# EAGLE design pan132x_breakout (EAGLE 7.1.0)
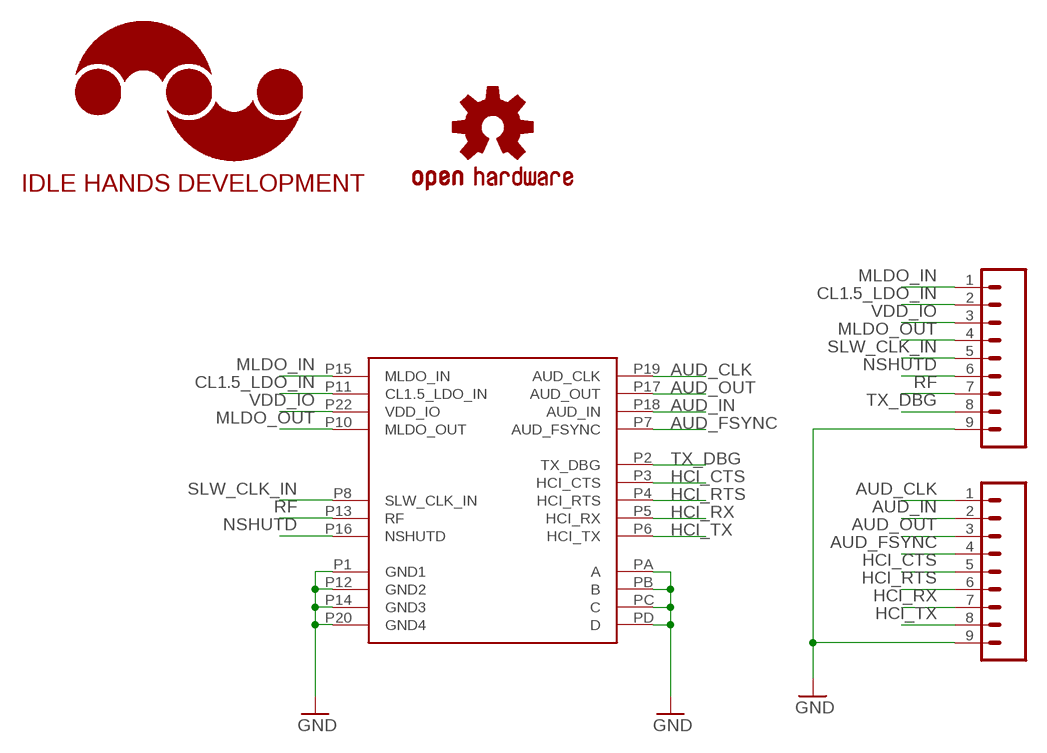
[diagram p0: schematic, sheet 1]

## Parts
JP1  M09LOCK  [1X09_LOCK]
JP2  M09LOCK  [1X09_LOCK]
LOGO1  IDLEHANDS_LOGOL  [IHD-LOGO-L]
LOGO2  OSHW-LOGOS  [OSHW-LOGO-S]
U$1  PAN132X  [PAN13XX]

## Nets
AUD_CLK: JP2.1 U$1.P19(AUD_CLK)
AUD_FSYNC: JP2.4 U$1.P7(AUD_FSYNC)
AUD_IN: JP2.2 U$1.P18(AUD_IN)
AUD_OUT: JP2.3 U$1.P17(AUD_OUT)
CL1.5_LDO_IN: JP1.2 U$1.P11(CL1.5_LDO_IN)
GND: JP1.9 JP2.9 U$1.P1(GND1) U$1.P12(GND2) U$1.P14(GND3) U$1.P20(GND4) U$1.PA(A) U$1.PB(B) U$1.PC(C) U$1.PD(D)
HCI_CTS: JP2.5 U$1.P3(HCI_CTS)
HCI_RTS: JP2.6 U$1.P4(HCI_RTS)
HCI_RX: JP2.7 U$1.P5(HCI_RX)
HCI_TX: JP2.8 U$1.P6(HCI_TX)
MLDO_IN: JP1.1 U$1.P15(MLDO_IN)
MLDO_OUT: JP1.4 U$1.P10(MLDO_OUT)
NSHUTD: JP1.6 U$1.P16(NSHUTD)
RF: JP1.7 U$1.P13(RF)
SLW_CLK_IN: JP1.5 U$1.P8(SLW_CLK_IN)
TX_DBG: JP1.8 U$1.P2(TX_DBG)
VDD_IO: JP1.3 U$1.P22(VDD_IO)

## Library data of the parts
JP1 JP2 = SparkFun-Connectors:M09: Header 9 Standard 9-pin 0.1" header. Use with straight break away headers (SKU : PRT-00116), right angle break away headers (PRT-00553), swiss pins (PRT-00743), machine pins (PRT-00117), and female headers (PRT-00115).
LOGO1 = IdleHandsProject:IDLEHANDS_LOGO: Open Source Hardware Logo This logo indicates the piece of hardware it is found on incorporates a OSHW license and/or adheres to the definition of open source hardware found here: http://freedomdefined.org/OSHW
LOGO2 = SparkFun-Aesthetics:OSHW-LOGO: Open Source Hardware Logo This logo indicates the piece of hardware it is found on incorporates a OSHW license and/or adheres to the definition of open source hardware found here: http://freedomdefined.org/OSHW
U$1 = BluetoothBLE_SPP:PAN132X

## Board
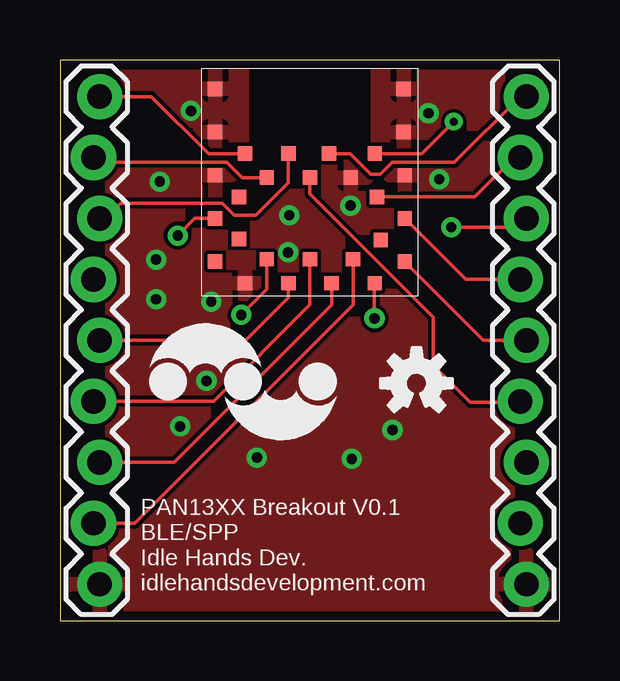
[diagram p1: board, top side]
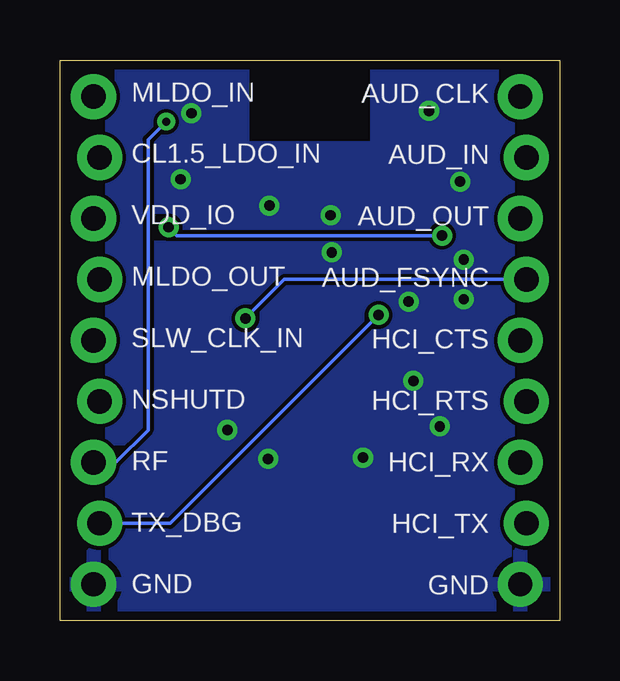
[diagram p2: board, bottom side, seen from below]

Size 20.83 x 23.37 mm. Coordinates in mm from the lower left corner, seen from the top.
Outline: 0,0 20.83,0 20.83,23.37 0,23.36 0,0
Copper layers (1*16): Top 0.035mm / dielectric 1.5mm / Bottom 0.035mm
Design rules "default *": minimum track width 6mil, minimum drill 6mil, track to track 6mil, track to pad 6mil, pad to pad 6mil, via to via 6mil, smd to smd 6mil, copper to edge 15mil, drill to drill 8mil, minimum pad ring 10mil, minimum via ring 8mil, stop-mask expansion 4mil, vias tented up to drill 0mil, thermal gap 10mil

### Footprints (pad centres in the part's own frame; a part is rotated, then mirrored left to right if it is on the bottom)
1X09_LOCK = drill 1.016 pad 1.88: 1 0,0.127; 2 2.54,-0.127; 3 5.08,0.127; 4 7.62,-0.127; 5 10.16,0.127; 6 12.7,-0.127; 7 15.24,0.127; 8 17.78,-0.127; 9 20.32,0.127
PAN13XX = smd 0.6 x 0.6: P1 -2.7,-2.7; P2 -1.8,-1.7; P3 -0.9,-2.7; P4 0,-1.7; P5 0.9,-2.7; P6 1.8,-1.7; P7 2.7,-2.7; P8 3.95,-1.8; P9 2.95,-0.9; P10 3.95,0; P11 2.8,0.9; P12 3.95,1.8; P13 2.7,2.7; P14 1.7,1.7; P15 0.8,2.7; P16 0,1.7; P17 -0.9,2.7; P18 -1.8,1.7; P19 -2.7,2.7; P20 -3.95,1.8; P21 -2.95,0.9; P22 -3.95,0; P23 -2.95,-0.85; P24 -3.95,-1.8; PA -3.95,3.6; PB 3.9,3.6; PC -3.95,5.4; PD 3.9,5.4

### Placement (x,y rotation side)
JP1  19.3,21.84 270 top
JP2  1.52,21.84 270 top
LOGO1  7.65,10 0 top
LOGO2  14.85,9.9 0 top
U$1  10.41,16.76 0 top

### Tracks (layer width: path | path; a pad name or v marks a point on that pad's centre or on a via)
AUD_CLK
  Top 0.152: U$1.P19 6.19,19.46 3.81,21.84 JP2.1
AUD_FSYNC  (via drill 0.43)
  Top 0.152: U$1.P7 v13.1,12.6
  Bottom 0.152: v13.1,12.6 11.48,14.22 JP2.4
AUD_IN
  Top 0.152: U$1.P18 7.59,18.46 6.95,19.1 1.85,19.1 1.65,19.3 JP2.2
AUD_OUT
  Top 0.152: U$1.P17 9.51,18.26 8.15,16.9 7.25,16.9 6.75,17.4 2.54,17.4 1.91,16.76 JP2.3
CL1.5_LDO_IN
  Top 0.152: U$1.P11 17.28,17.66 18.92,19.3 JP1.2
GND  (via drill 0.43)
  other vias: 6.3,13.3 4,15.05 4,13.4 15.8,18.4 12.1,17.3 15.35,21.15 5.45,21.25 9.55,16.9 9.5,15.35 4.15,18.3 13.85,7.95 12.15,6.75 8.2,6.8 5,8.1 6.1,10
  pour Bottom: 0,0 0,24.13 20.83,24.13 20.83,0
  pour Top: 0,0 0,24.13 20.83,24.13 20.83,0
HCI_CTS
  Top 0.152: U$1.P3 9.51,13.46 7.74,11.68 JP2.5
HCI_RTS
  Top 0.152: U$1.P4 10.41,13.16 6.4,9.14 JP2.6
HCI_RX
  Top 0.152: U$1.P5 11.31,13.16 4.76,6.6 JP2.7
HCI_TX
  Top 0.152: U$1.P6 12.21,13.16 3.12,4.06 JP2.8
MLDO_IN
  Top 0.152: U$1.P15 12.09,19.46 12.95,18.6 13.35,18.6 13.85,19.1 16.43,19.1 19.18,21.84 JP1.1
MLDO_OUT
  Top 0.152: U$1.P10 16.9,14.22 JP1.4
NSHUTD
  Top 0.152: U$1.P16 10.41,17.79 15.55,12.65 15.55,10.65 17.1,9.1 18.88,9.1 JP1.6
RF  (via drill 0.33)
  Top 0.152: U$1.P13 15.07,19.46 v16.4,20.8
  Bottom 0.152: v16.4,20.8 17.15,20.05 17.15,7.95 18.5,6.6 JP1.7
SLW_CLK_IN
  Top 0.152: U$1.P8 17.64,11.68 JP1.5
TX_DBG  (via drill 0.43)
  Top 0.152: U$1.P2 8.61,13.81 v7.55,12.75
  Bottom 0.152: v7.55,12.75 16.24,4.06 JP1.8
VDD_IO  (via drill 0.43)
  Top 0.152: U$1.P22 5.62,16.76 v4.9,16.05 | v16.3,16.4 18.81,16.4 19.18,16.76 JP1.3
  Bottom 0.152: v4.9,16.05 15.95,16.05 v16.3,16.4

### Text on the board
tNames: PAN13XX Breakout V0.1 / BLE/SPP / Idle Hands Dev. / idlehandsdevelopment.com
bNames: AUD_CLK / AUD_IN / AUD_OUT / AUD_FSYNC / HCI_CTS / HCI_RTS / HCI_RX / HCI_TX / GND | MLDO_IN / CL1.5_LDO_IN / VDD_IO / MLDO_OUT / SLW_CLK_IN / NSHUTD / RF / TX_DBG / GND